# EAGLE design Conductance (EAGLE 9.6.2)

## Sheet 1 of 2
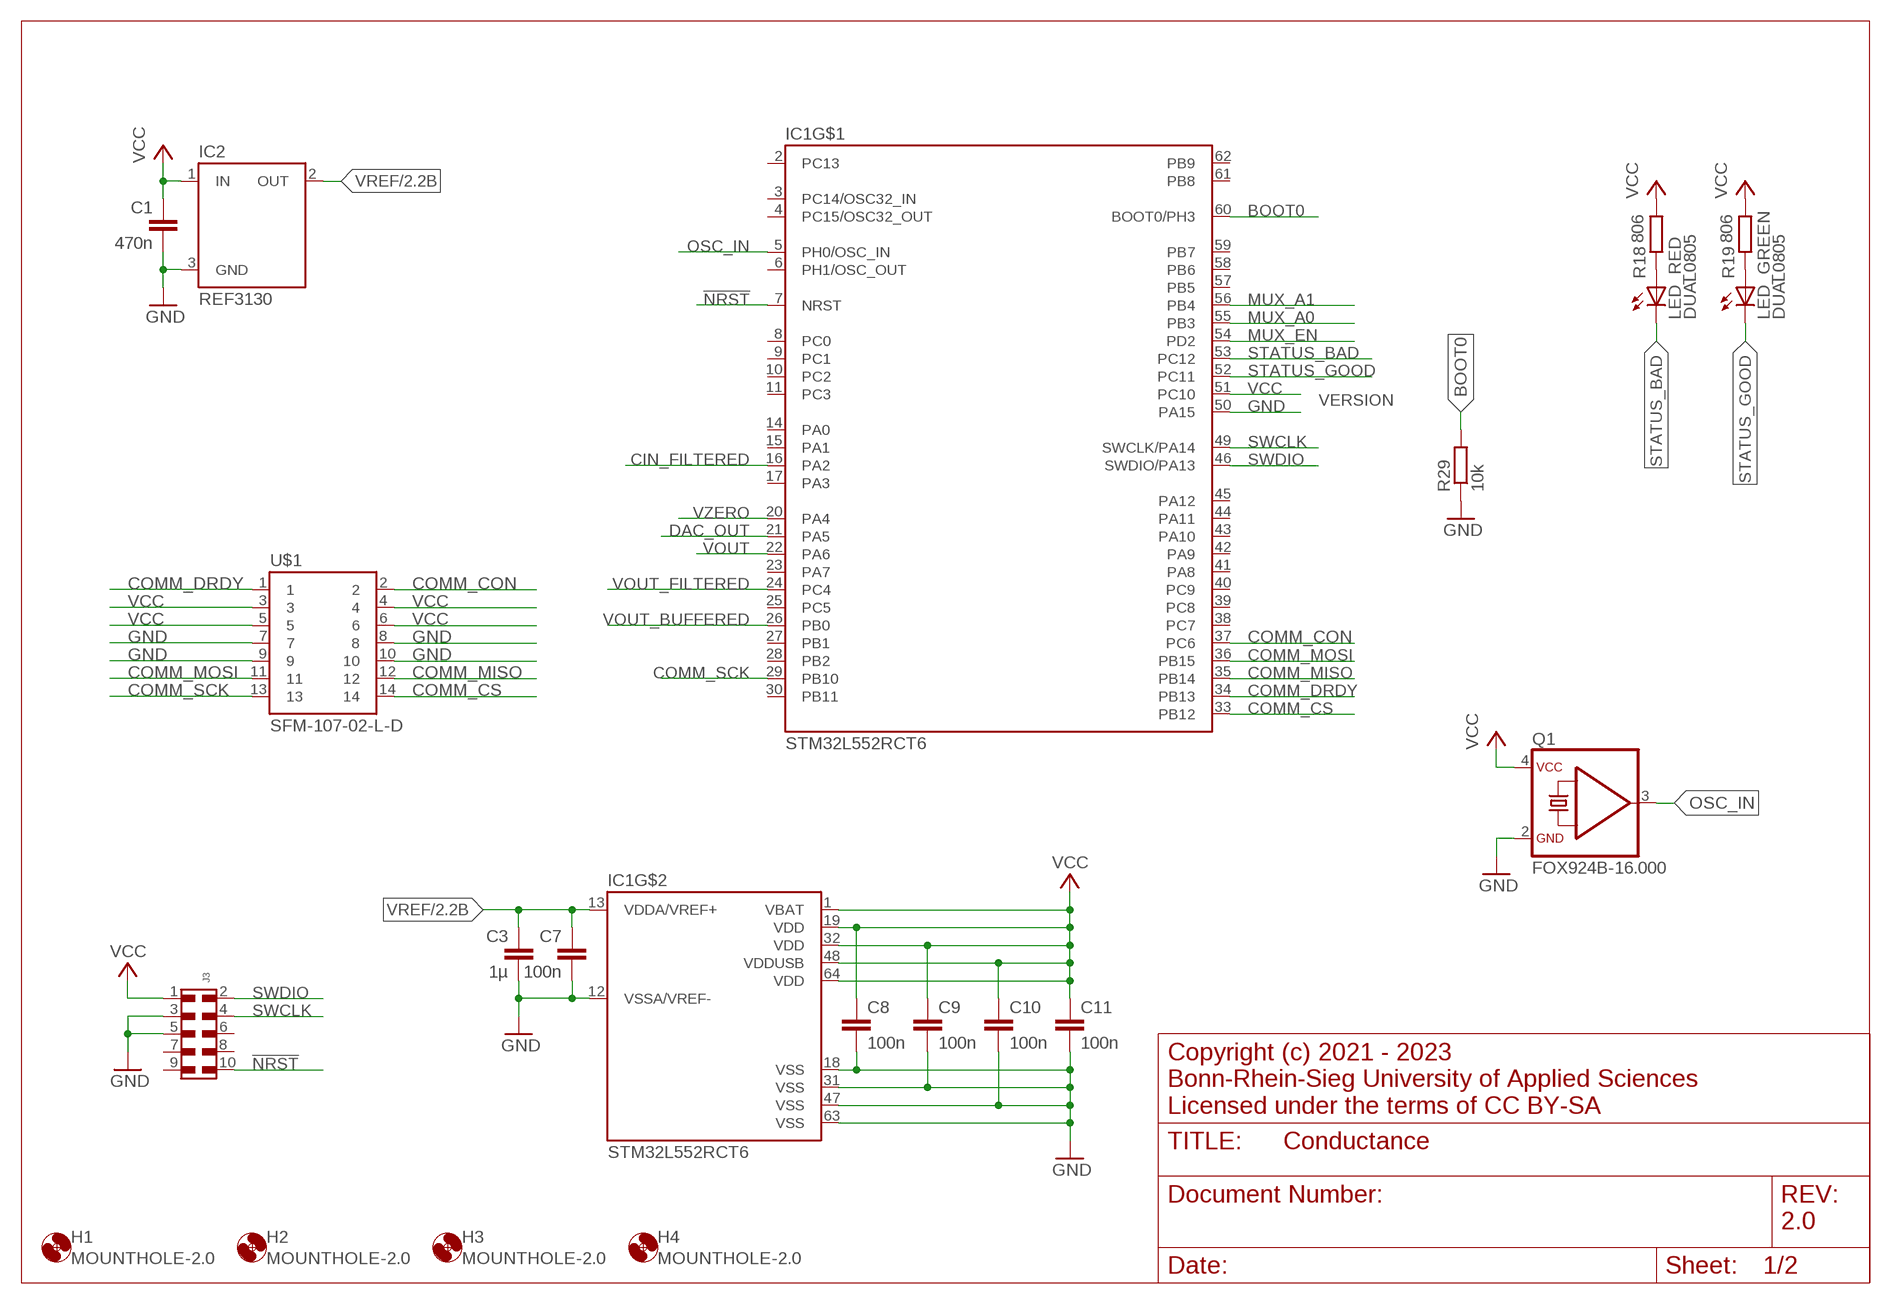
[diagram p0: schematic, sheet 1]

### Parts
C1  470n  C-EUC0603  [C0603]
C3  1µ  C-EUC0603  [C0603]
C7  100n  C-EUC0603  [C0603]
C8  100n  C-EUC0603  [C0603]
C9  100n  C-EUC0603  [C0603]
C10  100n  C-EUC0603  [C0603]
C11  100n  C-EUC0603  [C0603]
H1  MOUNTHOLE-2.0  [2.0]
H2  MOUNTHOLE-2.0  [2.0]
H3  MOUNTHOLE-2.0  [2.0]
H4  MOUNTHOLE-2.0  [2.0]
IC1  STM32L552RCT6  [LQFP64]
IC2  REF3130  [SOT23]
J3  6210XX21021_62101021021  [62101021021]
LED_  DUAL0805  [CHIPLEDX2]
Q1  FOX924B-16.000  [FOX924B]
R18  806  R-EU_R0603  [R0603]
R19  806  R-EU_R0603  [R0603]
R29  10k  R-EU_R0603  [R0603]
U$1  SFM-107-02-L-D  [SAMTEC-SFM-107-02-L-D]

### Nets
!NRST: IC1.7(NRST) J3.10
BOOT0: IC1.60(BOOT0/PH3) R29.2
CIN_FILTERED: IC1.16(PA2) ; also sheet 2
COMM_CON: IC1.37(PC6) U$1.2
COMM_CS: IC1.33(PB12) U$1.14
COMM_DRDY: IC1.34(PB13) U$1.1
COMM_MISO: IC1.35(PB14) U$1.12
COMM_MOSI: IC1.36(PB15) U$1.11
COMM_SCK: IC1.29(PB10) U$1.13
DAC_OUT: IC1.21(PA5) ; also sheet 2
GND: C1.2 C3.2 C7.2 C8.2 C9.2 C10.2 C11.2 IC1.12(VSSA/VREF-) IC1.18(VSS) IC1.31(VSS) IC1.47(VSS) IC1.50(PA15) IC1.63(VSS) IC2.3(GND) J3.3 J3.5 Q1.2(GND) R29.1 U$1.7 U$1.8 U$1.9 U$1.10 ; also sheet 2
MUX_A0: IC1.55(PB3) ; also sheet 2
MUX_A1: IC1.56(PB4) ; also sheet 2
MUX_EN: IC1.54(PD2) ; also sheet 2
N$28: LED_.A1(RED:A) R18.1
N$29: LED_.A2(GREEN:A) R19.1
OSC_IN: IC1.5(PH0/OSC_IN) Q1.3(OUT)
STATUS_BAD: IC1.53(PC12) LED_.C1(RED:C)
STATUS_GOOD: IC1.52(PC11) LED_.C2(GREEN:C)
SWCLK: IC1.49(SWCLK/PA14) J3.4
SWDIO: IC1.46(SWDIO/PA13) J3.2
VCC: C1.1 C8.1 C9.1 C10.1 C11.1 IC1.1(VBAT) IC1.19(VDD) IC1.32(VDD) IC1.48(VDDUSB) IC1.51(PC10) IC1.64(VDD) IC2.1(IN) J3.1 Q1.4(VCC) R18.2 R19.2 U$1.3 U$1.4 U$1.5 U$1.6 ; also sheet 2
VOUT: IC1.22(PA6) ; also sheet 2
VOUT_BUFFERED: IC1.26(PB0) ; also sheet 2
VOUT_FILTERED: IC1.24(PC4) ; also sheet 2
VREF: C3.1 C7.1 IC1.13(VDDA/VREF+) IC2.2(OUT) ; also sheet 2
VZERO: IC1.20(PA4) ; also sheet 2
Unconnected: IC1.2(PC13) IC1.3(PC14/OSC32_IN) IC1.4(PC15/OSC32_OUT) IC1.6(PH1/OSC_OUT) IC1.8(PC0) IC1.9(PC1) IC1.10(PC2) IC1.11(PC3) IC1.14(PA0) IC1.15(PA1) IC1.17(PA3) IC1.23(PA7) IC1.25(PC5) IC1.27(PB1) IC1.28(PB2) IC1.30(PB11) IC1.38(PC7) IC1.39(PC8) IC1.40(PC9) IC1.41(PA8) IC1.42(PA9) IC1.43(PA10) IC1.44(PA11) IC1.45(PA12) IC1.57(PB5) IC1.58(PB6) IC1.59(PB7) IC1.61(PB8) IC1.62(PB9) J3.6 J3.7 J3.8 J3.9

### Notes on the sheet
- VERSION
- Copyright (c) 2021 - 2023
  Bonn-Rhein-Sieg University of Applied Sciences
  Licensed under the terms of CC BY-SA
- 2.0

## Sheet 2 of 2
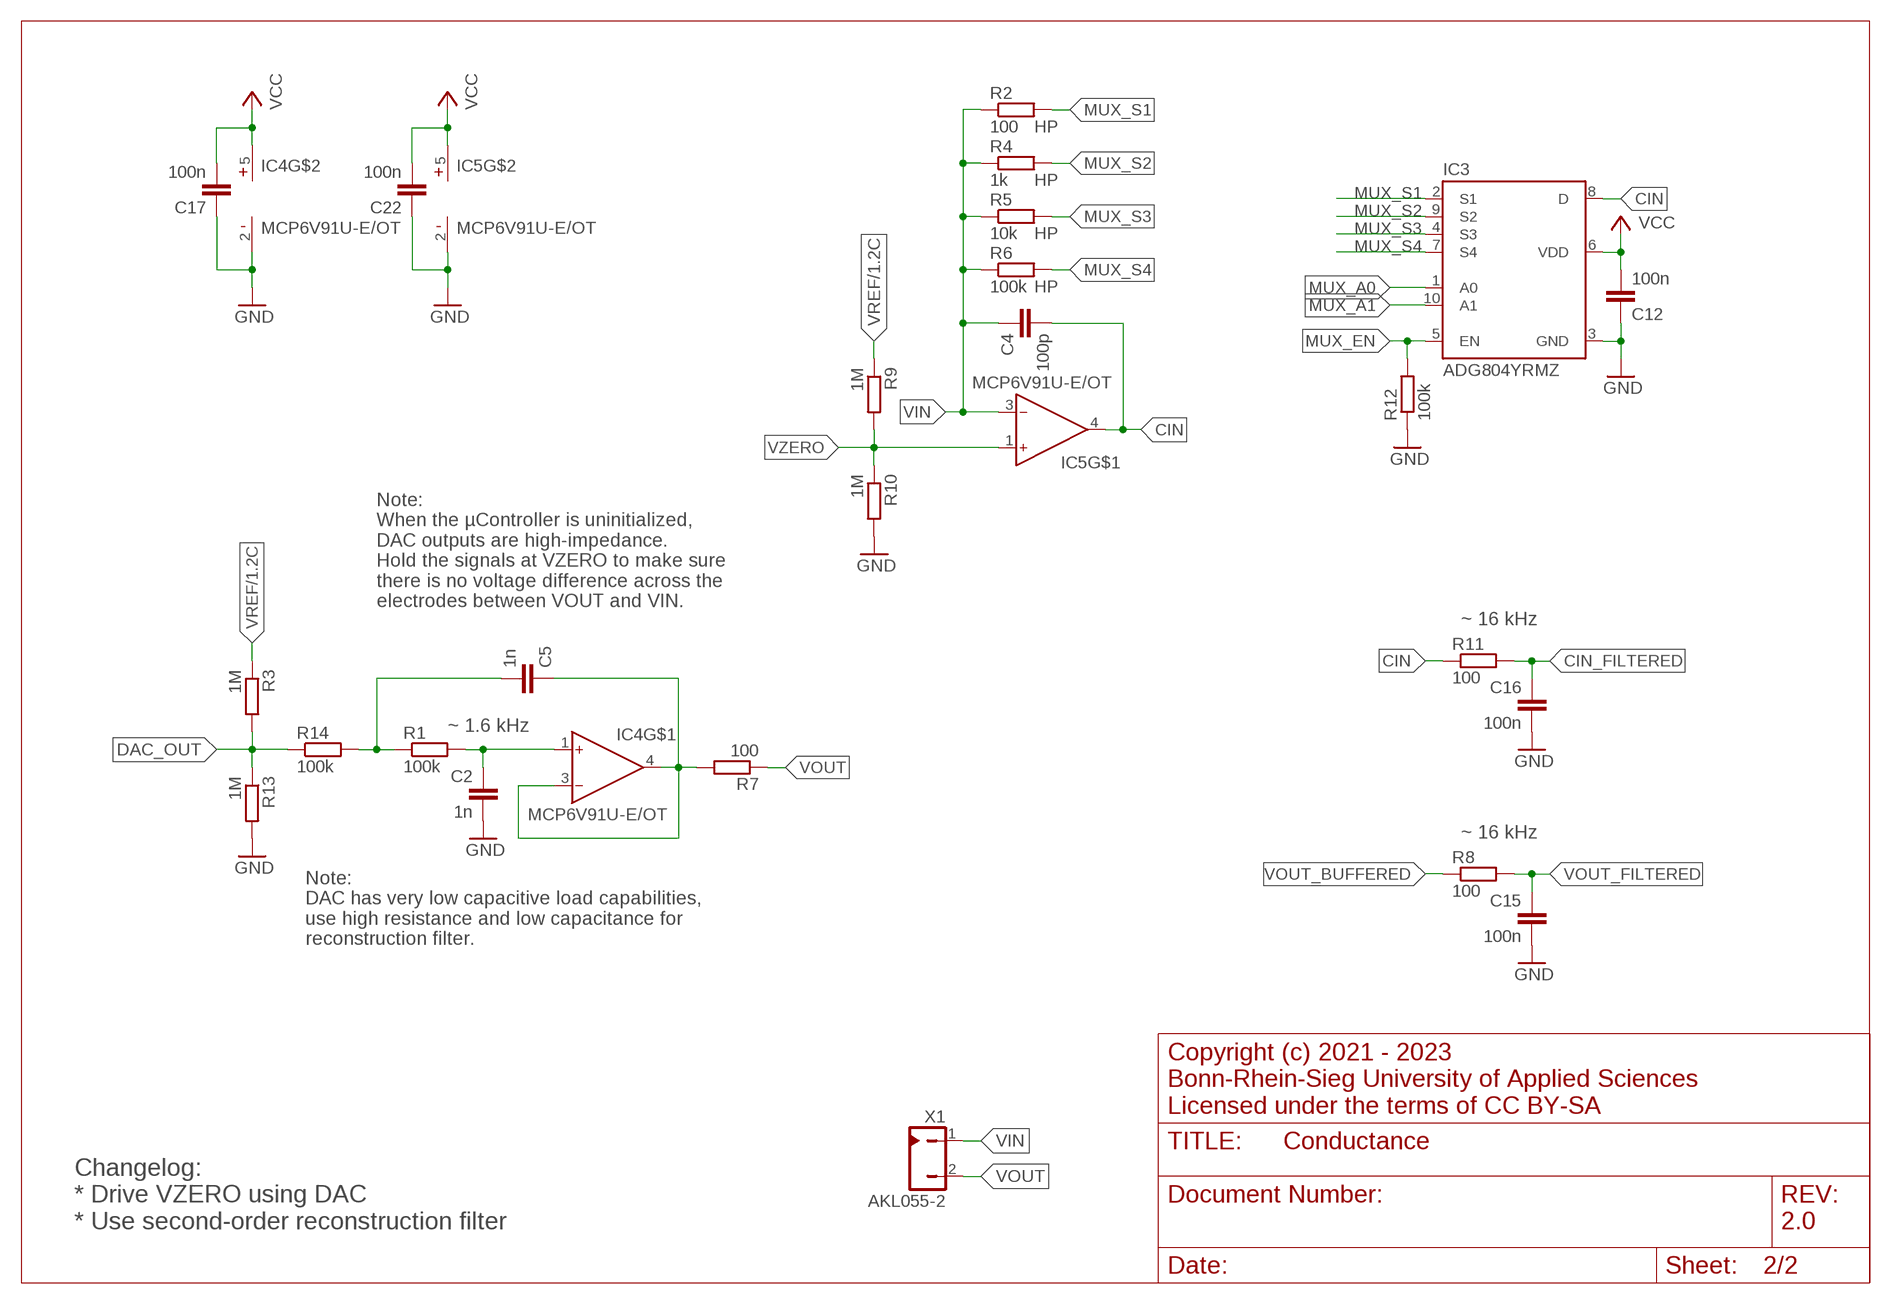
[diagram p1: schematic, sheet 2]

### Parts
C2  1n  C-EUC0603  [C0603]
C4  100p  C-EUC0603  [C0603]
C5  1n  C-EUC0603  [C0603]
C12  100n  C-EUC0603  [C0603]
C15  100n  C-EUC0603  [C0603]
C16  100n  C-EUC0603  [C0603]
C17  100n  C-EUC0603  [C0603]
C22  100n  C-EUC0603  [C0603]
IC3  ADG804YRMZ  [MSOP10]
IC4  MCP6V91U-E/OT  [SOT23-5]
IC5  MCP6V91U-E/OT  [SOT23-5]
R1  100k  R-EU_R0603  [R0603]
R2  100  R-EU_R0603  [R0603]
R3  1M  R-EU_R0603  [R0603]
R4  1k  R-EU_R0603  [R0603]
R5  10k  R-EU_R0603  [R0603]
R6  100k  R-EU_R0603  [R0603]
R7  100  R-EU_R0603  [R0603]
R8  100  R-EU_R0603  [R0603]
R9  1M  R-EU_R0603  [R0603]
R10  1M  R-EU_R0603  [R0603]
R11  100  R-EU_R0603  [R0603]
R12  100k  R-EU_R0603  [R0603]
R13  1M  R-EU_R0603  [R0603]
R14  100k  R-EU_R0603  [R0603]
X1  AKL055-2  [AKL055-2]

### Nets
CIN: C4.2 IC3.8(D) IC5.4(OUT) R11.1
CIN_FILTERED: C16.1 R11.2 ; also sheet 1
DAC_OUT: R3.2 R13.1 R14.1 ; also sheet 1
GND: C2.2 C12.1 C15.2 C16.2 C17.1 C22.1 IC3.3(GND) IC4.2(VSS) IC5.2(VSS) R10.2 R12.1 R13.2 ; also sheet 1
MUX_A0: IC3.1(A0) ; also sheet 1
MUX_A1: IC3.10(A1) ; also sheet 1
MUX_EN: IC3.5(EN) R12.2 ; also sheet 1
MUX_S1: IC3.2(S1) R2.2
MUX_S2: IC3.9(S2) R4.2
MUX_S3: IC3.4(S3) R5.2
MUX_S4: IC3.7(S4) R6.2
N$1: C5.2 R1.1 R14.2
N$2: C2.1 IC4.1(IN+) R1.2
N$3: C5.1 IC4.3(IN-) IC4.4(OUT) R7.2
VCC: C12.2 C17.2 C22.2 IC3.6(VDD) IC4.5(VDD) IC5.5(VDD) ; also sheet 1
VIN: C4.1 IC5.3(IN-) R2.1 R4.1 R5.1 R6.1 X1.1
VOUT: R7.1 X1.2 ; also sheet 1
VOUT_BUFFERED: R8.1 ; also sheet 1
VOUT_FILTERED: C15.1 R8.2 ; also sheet 1
VREF: R3.1 R9.1 ; also sheet 1
VZERO: IC5.1(IN+) R9.2 R10.1 ; also sheet 1

### Notes on the sheet
- Note:
  When the µController is uninitialized,
  DAC outputs are high-impedance.
  Hold the signals at VZERO to make sure
  there is no voltage difference across the
  electrodes between VOUT and VIN.
- ~ 16 kHz
- ~ 1.6 kHz
- ~ 16 kHz
- Note:
  DAC has very low capacitive load capabilities,
  use high resistance and low capacitance for
  reconstruction filter.
- Copyright (c) 2021 - 2023
  Bonn-Rhein-Sieg University of Applied Sciences
  Licensed under the terms of CC BY-SA
- Changelog:
  * Drive VZERO using DAC
  * Use second-order reconstruction filter
- 2.0

## Library data of the parts
C1-C5 C7-C12 C15-C17 C22 = rcl:C-EU: CAPACITOR, European symbol
H1-H4 = MountHoles:MOUNTHOLE-2.0
IC1 = STM32:STM32L552R*?: Ultra-low-power ARM Cortex-M33 32-bit MCU + TrustZone + FPU, 165 DMIPS, up to 512 KB Flash memory, 256 KB SRAM, SMPS
IC2 = REF31xx:REF31: 15ppm/°C Max, 100μA, SOT23-3 SERIES VOLTAGE REFERENCE
IC3 = ADG804:ADG804: 0.5 Ω CMOS 1.65 V TO 3.6 V 4-Channel Multiplexer
IC4 IC5 = MCP6V91:MCP6V91U-*/?: 10 MHz, Zero-Drift Op Amps
J3 = WR-PHD:6210XX21021_62101021021: WR-PHD 1.27 mm SMT Dual Pin Header, H=3.80 mm ARTICLE PROPERTIES: Pins:4;​ 8;​ 10;​ 14;​ 16;​ 20;​ 28;​ 40;​ 44;​ 50 KIND PROPERTIES: Pitch：1.27 mm Quality Class:3 as per CECC 75 301-802 Rows：Dual Gender：Pin Header Type：Straight MATERIAL PROPERTIES: Insulator Material :PA9T Insulator Flammability Rating:UL94 V-0 Contact Material:Copper Alloy Contact Plating:Gold Contact Type:Stamped GENERAL INFORMATION Operating Temperature:-40 up to +105 °C Compliance:Lead free / RoHS ELECTRICAL PROPERTIES: Rated Current:1 A;​ max. IR1:1 A Withstanding Voltage:500 V (AC) Contact Resistance:20 mΩ RISO:1000 MΩ CERTIFICATION UL Approval:E323964 PACKAGING PROPERTIES Packaging:Tube Packaging Unit:228;​ 114;​ 91;​ 65;​ 57;​ 45;​ 32;​ 23;​ 20;​ 18 <https://katalog.we-online.com/media/images/v2/o33195v209%20Family_WR-PDH_621xxx21021.jpg> Details see: https://katalog.we-online.com/en/em/PHD_1_27_SMT_DUAL_PIN_HEADER_6210XX21021 Updated by Yingchun,Shan 2019-10-25 2019 (C) Würth Elektronik; DATASHEET-URL: https://katalog.we-online.com/em/datasheet/62101021021.pdf; GENDER: Pin Header; IR: 1A; MATES: WR-PHD 1.27mm Dual Socket Header/SMT Dual Socket Header,H=4.5mm/SMT Dual Socket Header,H=4.5mm(Reel); PACKAGING: Tube; PART-NUMBER: 62101021021; PINS: 10; ROWS: Dual; TYPE: Straight
LED_ = DualLED:DUAL0805: Kingbright APHBM2012SURKCGKC (www.digikey.de/product-detail/de/kingbright/APHBM2012SURKCGKC/754-1093-1-ND/1747810)
Q1 = FOX924B:FOX924B
R1-R14 R18 R19 R29 = rcl:R-EU_: RESISTOR, European symbol
U$1 = SFM-10x-02-L-D:SFM-107-02-L-D
X1 = AKL055:AKL055-2

## Board
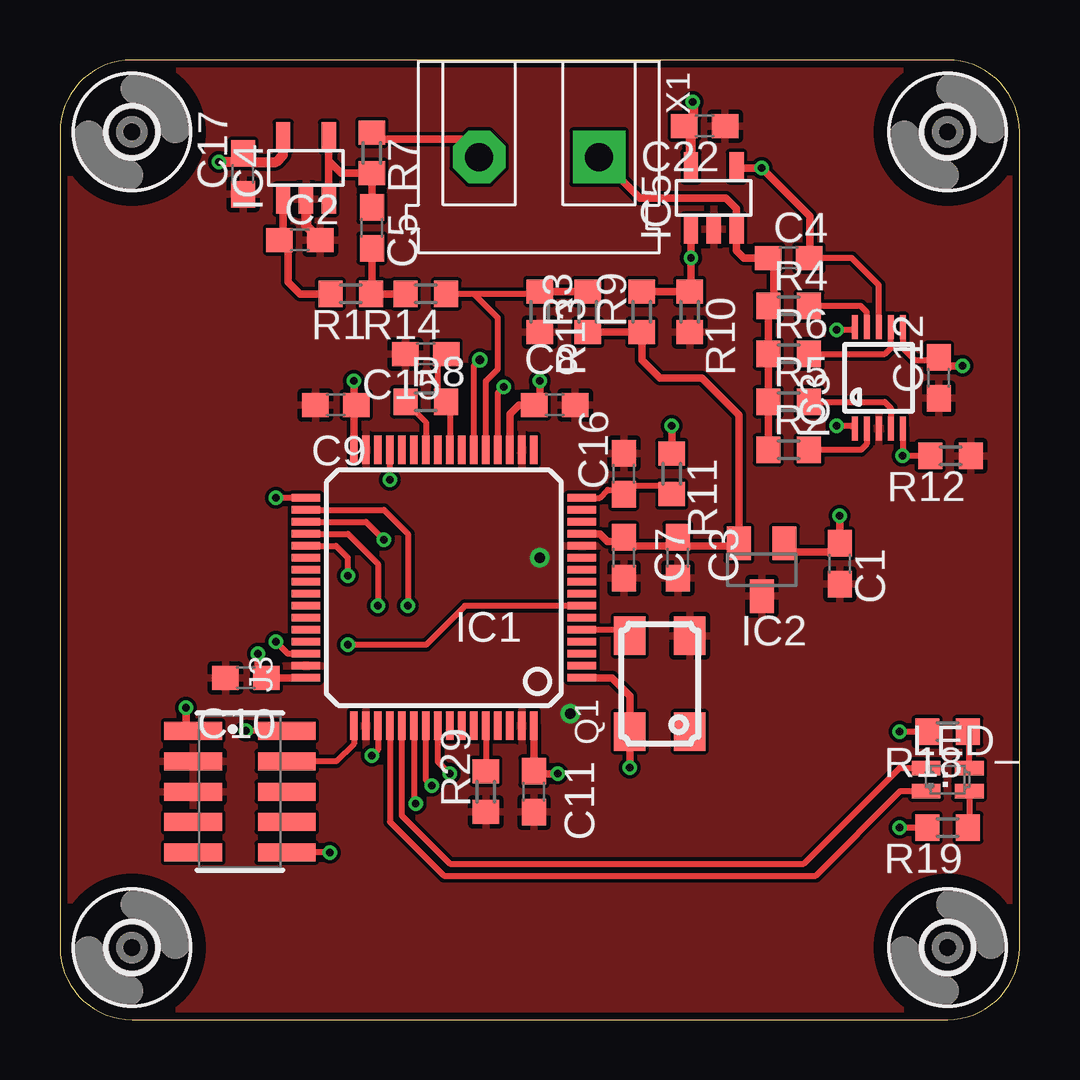
[diagram p2: board, top side]
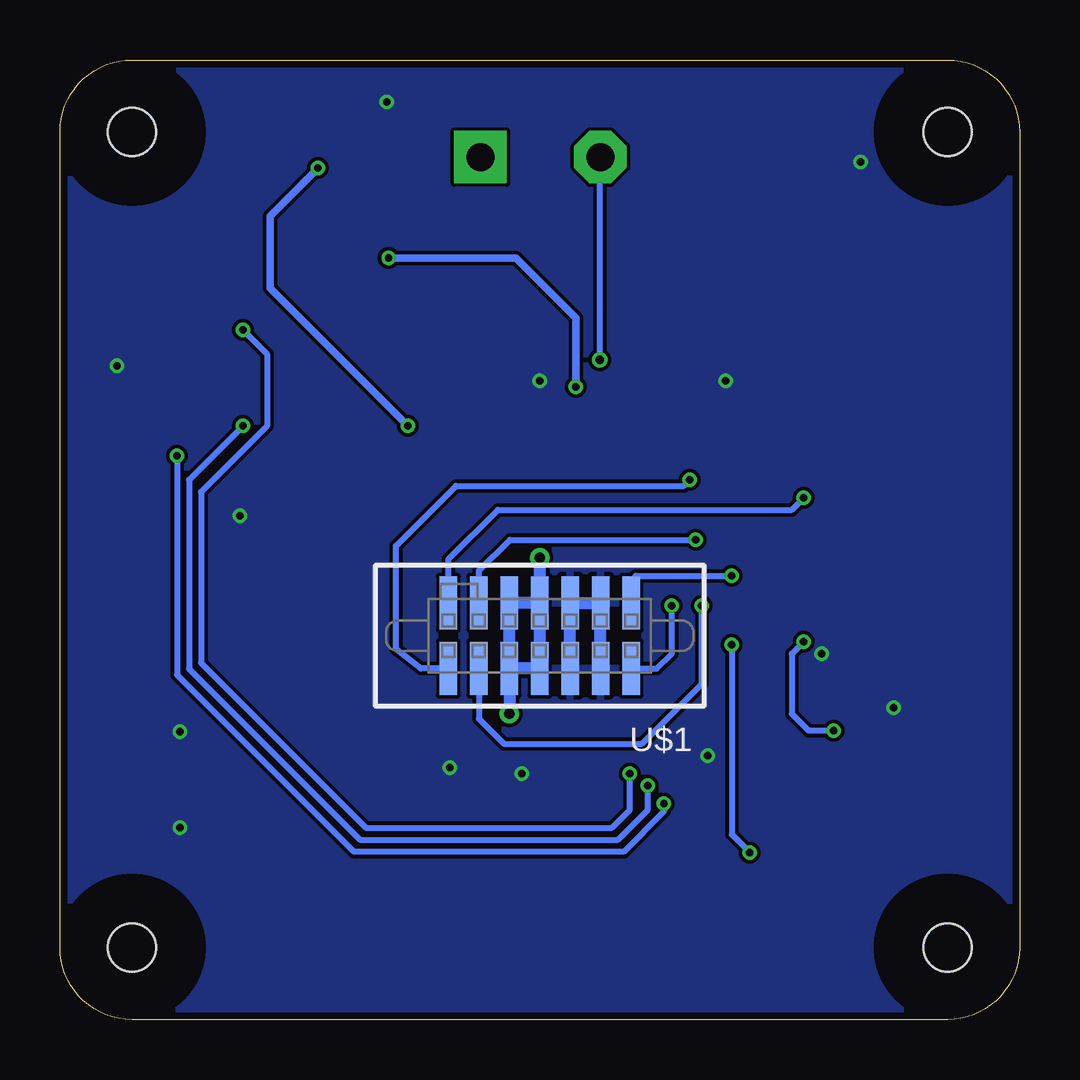
[diagram p3: board, bottom side, seen from below]

Size 40 x 40 mm. Coordinates in mm from the lower left corner, seen from the top.
Outline: 3,0 37,0 arc90 40,3 40,37 arc90 37,40 3,40 arc90 0,37 0,3 arc90 3,0
Copper layers (1*16): Top 0.035mm / dielectric 1.5mm / Bottom 0.035mm
Design rules "PCB-POOL Standard": minimum track width 0.15mm, minimum drill 0.3mm, track to track 0.15mm, track to pad 0.15mm, pad to pad 0.15mm, via to via 0.15mm, smd to smd 0.15mm, copper to edge 0.3mm, drill to drill 0.2mm, minimum pad ring 0.2mm, minimum via ring 0.15mm, stop-mask expansion 0.075mm, vias tented up to drill 0mil, thermal gap 0.2mm

### Footprints (pad centres in the part's own frame; a part is rotated, then mirrored left to right if it is on the bottom)
C0603 = smd 1.1 x 1: 1 -0.85,0; 2 0.85,0
2.0 = hole 2: 0,0
LQFP64 = smd 0.3 x 1.2: 1 -3.75,-5.75; 2 -3.25,-5.75; 3 -2.75,-5.75; 4 -2.25,-5.75; 5 -1.75,-5.75; 6 -1.25,-5.75; 7 -0.75,-5.75; 8 -0.25,-5.75; 9 0.25,-5.75; 10 0.75,-5.75; 11 1.25,-5.75; 12 1.75,-5.75; 13 2.25,-5.75; 14 2.75,-5.75; 15 3.25,-5.75; 16 3.75,-5.75; 33 3.75,5.75; 34 3.25,5.75; 35 2.75,5.75; 36 2.25,5.75; 37 1.75,5.75; 38 1.25,5.75; 39 0.75,5.75; 40 0.25,5.75; 41 -0.25,5.75; 42 -0.75,5.75; 43 -1.25,5.75; 44 -1.75,5.75; 45 -2.25,5.75; 46 -2.75,5.75; 47 -3.25,5.75; 48 -3.75,5.75 | smd 1.2 x 0.3: 17 5.75,-3.75; 18 5.75,-3.25; 19 5.75,-2.75; 20 5.75,-2.25; 21 5.75,-1.75; 22 5.75,-1.25; 23 5.75,-0.75; 24 5.75,-0.25; 25 5.75,0.25; 26 5.75,0.75; 27 5.75,1.25; 28 5.75,1.75; 29 5.75,2.25; 30 5.75,2.75; 31 5.75,3.25; 32 5.75,3.75; 49 -5.75,3.75; 50 -5.75,3.25; 51 -5.75,2.75; 52 -5.75,2.25; 53 -5.75,1.75; 54 -5.75,1.25; 55 -5.75,0.75; 56 -5.75,0.25; 57 -5.75,-0.25; 58 -5.75,-0.75; 59 -5.75,-1.25; 60 -5.75,-1.75; 61 -5.75,-2.25; 62 -5.75,-2.75; 63 -5.75,-3.25; 64 -5.75,-3.75
SOT23 = smd 1 x 1.4: 1 -0.95,-1.1; 2 0.95,-1.1; 3 0,1.1
MSOP10 = smd 0.25 x 1: 1 -1,-2.113; 2 -0.5,-2.113; 3 0,-2.113; 4 0.5,-2.113; 5 1,-2.113; 6 1,2.113; 7 0.5,2.113; 8 0,2.113; 9 -0.5,2.113; 10 -1,2.113
SOT23-5 = smd 0.6 x 1.2: 1 -0.95,-1.306; 2 0,-1.306; 3 0.95,-1.306; 4 0.95,1.306; 5 -0.95,1.306
62101021021 = smd 0.75 x 2.4: 1 -2.54,-1.95; 2 -2.54,1.95; 3 -1.27,-1.95; 4 -1.27,1.95; 5 0,-1.95; 6 0,1.95; 7 1.27,-1.95; 8 1.27,1.95; 9 2.54,-1.95; 10 2.54,1.95
CHIPLEDX2 = smd 0.6 x 1.2: A1 -0.475,0.9; A2 0.475,0.9; C1 -0.475,-0.9; C2 0.475,-0.9
FOX924B = smd 1.6 x 1.3: 1 -2,-1.25; 2 2,-1.25; 3 2,1.25; 4 -2,1.25
R0603 = smd 1 x 1.1: 1 -0.85,0; 2 0.85,0
SAMTEC-SFM-107-02-L-D = smd 0.74 x 2.22: 1 -3.81,1.365; 2 -3.81,-1.365; 3 -2.54,1.365; 4 -2.54,-1.365; 5 -1.27,1.365; 6 -1.27,-1.365; 7 0,1.365; 8 0,-1.365; 9 1.27,1.365; 10 1.27,-1.365; 11 2.54,1.365; 12 2.54,-1.365; 13 3.81,1.365; 14 3.81,-1.365
AKL055-2 = drill 1.168 pad 2.184 square: 1 2.525,4.045 | drill 1.168 pad 2.184 octagon: 2 7.525,4.045

### Placement (x,y rotation side)
C1  32.5,19 270 top
C2  10,32.5 0 top
C3  25.75,19.25 270 top
C4  30.38,31.75 0 top
C5  13,33 270 top
C7  23.5,19.25 270 top
C8  20.62,25.62 0 top
C9  11.5,25.62 180 top
C10  7.75,14.25 180 top
C11  19.75,9.5 270 top
C12  36.62,26.75 90 top
C15  15.25,27.75 180 top
C16  23.5,22.75 90 top
C17  7.62,35.25 90 top
C22  26.88,37.25 180 top
H1  3,3 0 top
H2  37,3 0 top
H3  37,37 0 top
H4  3,37 0 top
IC1  16,18 90 top
IC2  29.25,18.75 180 top
IC3  34.12,26.75 0 top
IC4  10.25,35.5 0 top
IC5  27.25,34.25 0 top
J3  7.5,9.5 270 top
LED_  37,10 270 top
Q1  25,14 90 top
R1  12.12,30.25 180 top
R2  30.38,23.75 0 top
R3  22,29.5 90 top
R4  30.38,29.75 0 top
R5  30.38,25.75 0 top
R6  30.38,27.75 0 top
R7  13,36.12 270 top
R8  15.25,25.75 0 top
R9  24.25,29.5 90 top
R10  26.25,29.5 270 top
R11  25.5,22.75 270 top
R12  37.12,23.5 180 top
R13  20,29.5 270 top
R14  15.25,30.25 180 top
R18  37,12 180 top
R19  37,8 180 top
R29  17.75,9.5 90 top
U$1  20,16 180 bottom
X1  25,40 180 top

### Tracks (layer width: path | path; a pad name or v marks a point on that pad's centre or on a via)
!NRST  (via drill 0.3)
  Top 0.254: IC1.7 16.88,17.25 15.25,15.62 v12,15.62 | v11.25,6.96 J3.10
  Bottom 0.254: v12,15.62 12,7.71 v11.25,6.96
BOOT0
  Top 0.254: IC1.60 R29.2
CIN  (via drill 0.3)
  Top 0.254: C4.2 33,31.75 34.12,30.62 IC3.8
  Top 0.305: IC5.4 28.26,35.5 v29.25,35.5 31.25,33.5 31.25,31.77 C4.2 | R11.1 v25.5,24.75
  Bottom 0.305: v29.25,35.5 31.25,33.5 31.25,30.5 v25.5,24.75
CIN_FILTERED
  Top 0.254: R11.2 25.15,22.25 23.85,22.25 23.68,22.07 | C16.1 23.68,22.07 | IC1.16 22.5,21.75 22.82,22.07 23.68,22.07
COMM_CON  (via drill 0.3)
  Top 0.254: v12,18.5 12,19.25 11.5,19.75 IC1.37
  Bottom 0.254: U$1.2 16.19,18.31 16,18.5 v12,18.5
COMM_CS  (via drill 0.3)
  Top 0.254: IC1.33 v9,21.75
  Bottom 0.254: U$1.14 23.81,19.19 21.75,21.25 9.5,21.25 v9,21.75
COMM_DRDY  (via drill 0.3)
  Top 0.254: IC1.34 13.5,21.25 14.5,20.25 v14.5,17.25
  Bottom 0.254: U$1.1 15.12,14.63 14.5,15.25 v14.5,17.25
COMM_MISO  (via drill 0.3)
  Top 0.254: v13.5,20 12.75,20.75 IC1.35
  Bottom 0.254: U$1.12 22.54,18.71 21.25,20 v13.5,20
COMM_MOSI  (via drill 0.3)
  Top 0.254: IC1.36 12,20.25 13.25,19 v13.25,17.25
  Bottom 0.254: U$1.11 22.54,12.54 21.5,11.5 15.75,11.5 13.25,14 v13.25,17.25
COMM_SCK  (via drill 0.3)
  Top 0.254: v13.75,22.5 IC1.29
  Bottom 0.254: U$1.13 24.96,14.63 26,15.44 26,19.75 23.5,22.25 14,22.25 v13.75,22.5
DAC_OUT
  Top 0.254: IC1.21 17.75,26.62 18.25,27.12 18.25,29.25 17.25,30.25 | 17.25,30.25 17,30.25 R14.1 | R13.1 19.9,30.25 17.25,30.25
  Top 0.305: R3.2 R13.1
GND  (via drill 0.45)
  Top 0.406: C2.2 10.25,33.1 IC4.2
  Bottom 0.508: U$1.8 U$1.7 U$1.9 | U$1.9 U$1.10 U$1.8 | U$1.8 v20,19.25 | U$1.9 v21.27,12.75
  pour Top: 3,0 37,0 arc90 40,3 40,37 arc90 37,40 3,40 arc90 0,37 0,3 arc90
MUX_A0  (via drill 0.3)
  Top 0.254: IC3.1 33.01,24.75 v32.38,24.75 | v15.5,9.75 15.25,10 IC1.55
  Bottom 0.254: v32.38,24.75 34.62,22.5 34.62,14.62 27.5,7.5 16.75,7.5 15.5,8.75 v15.5,9.75
MUX_A1  (via drill 0.3)
  Top 0.254: IC3.10 33.01,28.75 v32.38,28.75 | v16.25,10.25 15.75,10.75 IC1.56
  Bottom 0.254: v32.38,28.75 31.38,27.75 31.38,24.75 34.12,22 34.12,14.88 27.25,8 17,8 16.25,8.75 v16.25,10.25
MUX_EN  (via drill 0.3)
  Top 0.254: IC1.54 14.75,9.08 v14.83,9 | IC3.5 v35.12,23.5 R12.2
  Bottom 0.254: v35.12,23.5 35.12,14.38 27.75,7 16.5,7 14.83,8.67 v14.83,9
MUX_S1
  Top 0.254: IC3.2 33.62,24 33.38,23.75 R2.2
MUX_S2
  Top 0.254: IC3.9 33.62,29.5 33.38,29.75 R4.2
MUX_S3
  Top 0.254: R5.2 34.38,25.75 34.62,25.5 IC3.4
MUX_S4
  Top 0.254: IC3.7 34.62,28 34.38,27.75 R6.2
N$1
  Top 0.305: R14.2 R1.1 13,30.27 C5.2
N$2
  Top 0.305: R1.2 10,30.25 9.5,30.75 9.5,32.15 C2.1 9.3,32.65 IC4.1
N$3
  Top 0.305: C5.1 R7.2 11.72,35.27 11.2,35.8 | IC4.4 11.2,36.25 11.2,35.8 | IC4.3 11.2,35.8
N$28
  Top 0.254: LED_.A1 37.9,11.95 R18.1
N$29
  Top 0.254: LED_.A2 37.9,8.05 R19.1
OSC_IN
  Top 0.254: Q1.3 23.5,16.25 IC1.5
STATUS_BAD
  Top 0.254: LED_.C1 36.08,10.5 35,10.5 31,6.5 16.25,6.5 14.25,8.5 IC1.53
STATUS_GOOD
  Top 0.254: LED_.C2 35.02,9.53 31.5,6 16,6 13.75,8.25 IC1.52
SWCLK
  Top 0.254: IC1.49 12.25,11.5 11.52,10.77 J3.4
SWDIO  (via drill 0.3)
  Top 0.254: IC1.46 9.5,15.25 v9,15.75 | J3.2 v7.75,12.04
  Bottom 0.254: v9,15.75 9.5,15.25 9.5,12.75 8.79,12.04 v7.75,12.04
VCC  (via drill 0.3)
  Top 0.254: R19.2 v35,8 | R18.2 v35,12 | IC3.6 35.12,28 35.62,27.5 36.52,27.5 C12.2 | IC1.51 13.25,11.25 v13,11
  Top 0.305: IC1.32 12.25,25.43 C9.1 12.25,25.82 v12.25,26.62 | IC1.64 C11.1 19.95,10.25 v20.75,10.25 | v23.75,10.5 Q1.4 23.75,13.5 23,14.25 IC1.1 | v32.5,21 C1.1 32.15,19.5 30.55,19.5 IC2.1 | C12.2 36.98,27.25 v37.62,27.25 | IC1.48 C10.1 8.25,14.6 v8.25,15.25 | J3.1 5.25,12.34 v5.25,13 | IC1.19 18.75,25.25 19.12,25.62 C8.1 20,25.85 v20,26.62
  Top 0.406: v26.38,38.25 26.38,37.6 C22.2 26.3,36.98 IC5.5 | v6.62,35.75 7.28,35.75 C17.2 7.97,35.75 9,35.75 9.3,36.05 IC4.5
  Bottom 0.508: U$1.5 U$1.6 U$1.4 U$1.3
  pour Bottom: 3,40 37,40 arc-90 40,37 40,36.25 40,3 arc-90 37,0 3,0 arc-90 0,3 0,37 arc-90
VIN
  Top 0.305: R2.1 R5.1 R6.1 R4.1 29.75,29.98 29.75,31.52 C4.1 28.5,31.75 28.2,32.05 28.2,32.75 IC5.3 28.2,33.8 27.75,34.25 24.18,34.25 X1.1
VOUT  (via drill 0.35)
  Top 0.254: IC1.22 17.25,27.25 v17.5,27.5
  Top 0.305: X1.2 16.73,36.7 13.27,36.7 R7.1
  Bottom 0.254: X1.2 17.5,35.93 v17.5,27.5
VOUT_BUFFERED
  Top 0.254: IC1.26 15.25,24.9 R8.1
VOUT_FILTERED
  Top 0.254: IC1.24 16.25,25.6 R8.2 15.75,26.1 15.75,27.4 C15.1
VREF
  Top 0.305: 23.68,19.93 23.85,19.75 25.4,19.75 C3.1 26.1,19.75 28.2,19.75 IC2.2 28.3,25.2 26.75,26.75 25,26.75 24.25,27.5 R9.1 R3.1 | 23.68,19.93 C7.1 | IC1.13 22.5,20.25 22.82,19.93 23.68,19.93
VZERO  (via drill 0.3)
  Top 0.254: IC1.20 18.25,26.12 v18.5,26.38
  Top 0.305: R9.2 R10.1 26.3,30.4 v26.3,31.75 IC5.1
  Bottom 0.305: v18.5,26.38 18.5,29.25 21,31.75 v26.3,31.75

### Text on the board
tStop: Conductance | 3.1 | 1 | Hochschule / Bonn-Rhein-Sieg